# EAGLE design pc shield (EAGLE 8.3.2)
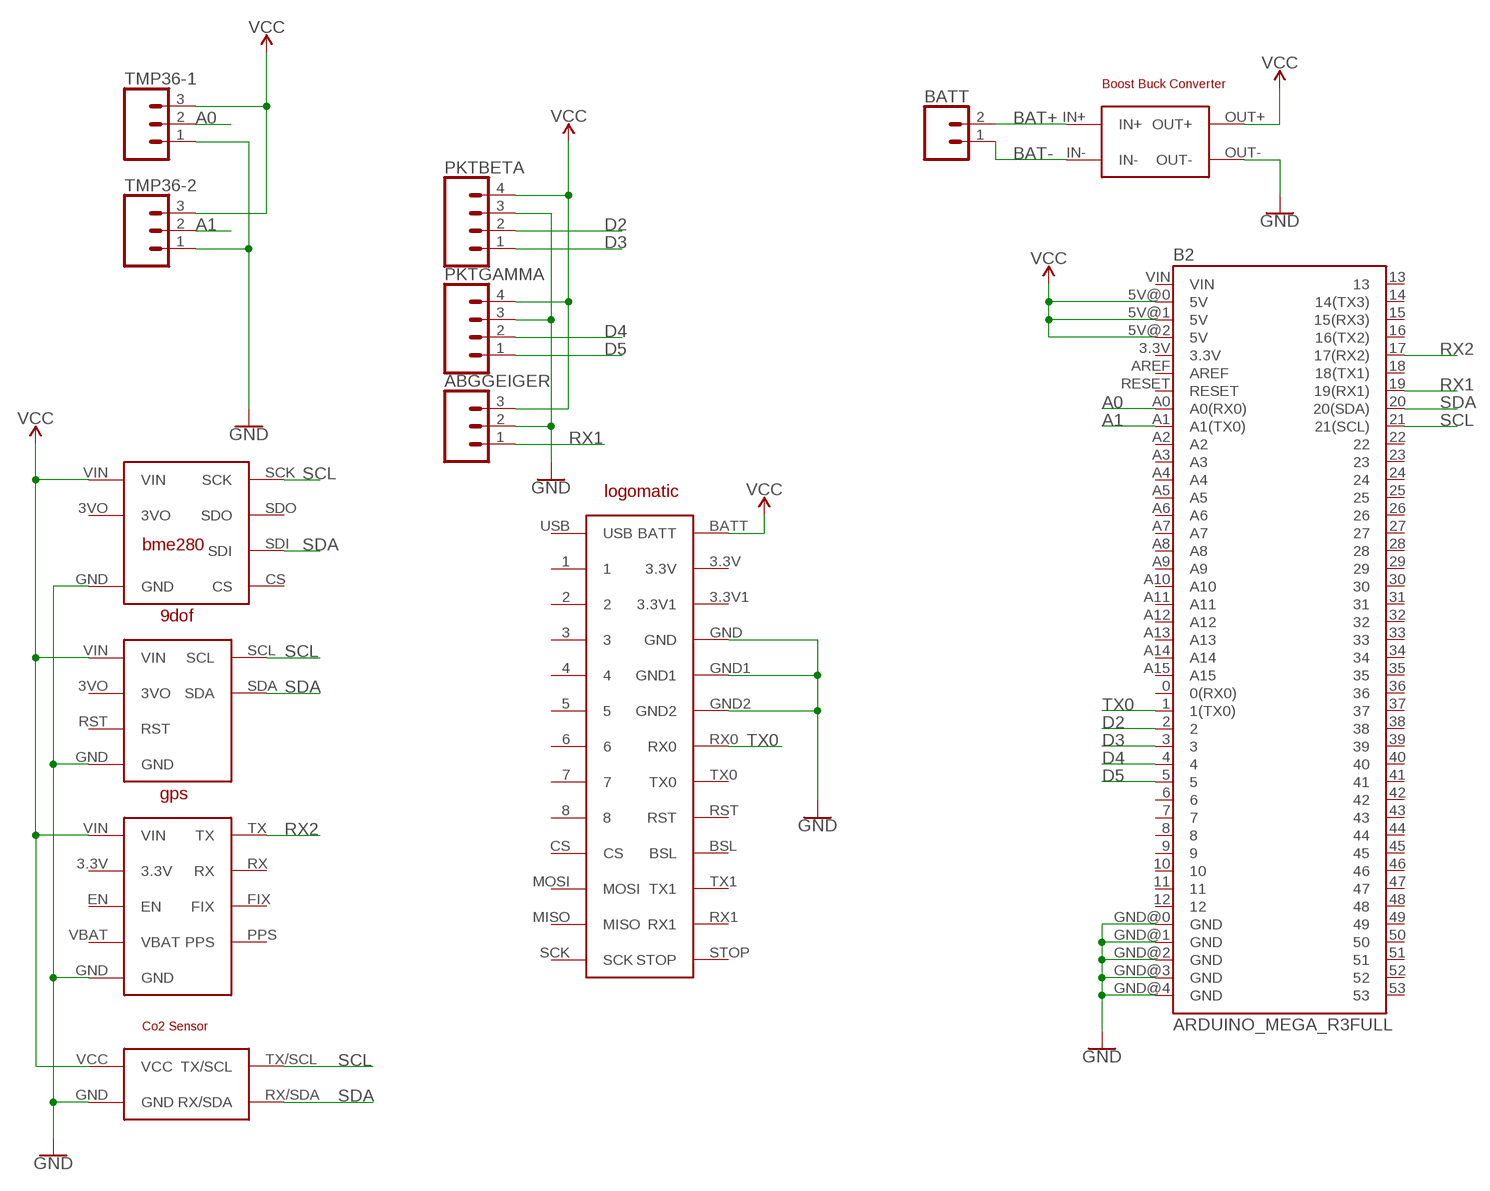
[diagram p0: schematic, sheet 1]

## Parts
ABGGEIGER  CONN_03  [1X03]
B2  ARDUINO_MEGA_R3FULL  [ARDUINO_MEGA]
BATT  CONN_02  [1X02]
PKTBETA  CONN_04  [1X04]
PKTGAMMA  CONN_04  [1X04]
TMP36-1  CONN_03  [1X03]
TMP36-2  CONN_03  [1X03]
U$1  ULTIMATEGPS  [ULTIMATEGPSPKG]
U$2  BME280  [BME280ADAFRUITPKG]
U$3  LOGOMATIC  [LOGOMATICPKG]
U$4  NXP9DOF  [NXP9DOFPKG]
U$5  CO2SENSOR  [CO2INTERFACEBOARDPKG]
U$6  BOOSTBUCK  [BOOSTBUCKPKG]

## Nets
A0: B2.A0(A0(RX0)) TMP36-1.2
A1: B2.A1(A1(TX0)) TMP36-2.2
BAT+: BATT.2 U$6.IN+
BAT-: BATT.1 U$6.IN-
D2: B2.2 PKTBETA.2
D3: B2.3 PKTBETA.1
D4: B2.4 PKTGAMMA.2
D5: B2.5 PKTGAMMA.1
GND: ABGGEIGER.2 B2.GND@0(GND) B2.GND@1(GND) B2.GND@2(GND) B2.GND@3(GND) B2.GND@4(GND) PKTBETA.3 PKTGAMMA.3 TMP36-1.1 TMP36-2.1 U$1.GND U$2.GND U$3.GND U$3.GND1 U$3.GND2 U$4.GND U$5.GND U$6.OUT-
RX1: ABGGEIGER.1 B2.19(19(RX1))
RX2: B2.17(17(RX2)) U$1.TX
SCL: B2.21(21(SCL)) U$2.SCK U$4.SCL U$5.TX/SCL
SDA: B2.20(20(SDA)) U$2.SDI U$4.SDA U$5.RX/SDA
TX0: B2.1(1(TX0)) U$3.RX0
VCC: ABGGEIGER.3 B2.5V@0(5V) B2.5V@1(5V) B2.5V@2(5V) PKTBETA.4 PKTGAMMA.4 TMP36-1.3 TMP36-2.3 U$1.VIN U$2.VIN U$3.BATT U$4.VIN U$5.VCC U$6.OUT+
Unconnected: B2.0(0(RX0)) B2.3.3V B2.6 B2.7 B2.8 B2.9 B2.10 B2.11 B2.12 B2.13 B2.14(14(TX3)) B2.15(15(RX3)) B2.16(16(TX2)) B2.18(18(TX1)) B2.22 B2.23 B2.24 B2.25 B2.26 B2.27 B2.28 B2.29 B2.30 B2.31 B2.32 B2.33 B2.34 B2.35 B2.36 B2.37 B2.38 B2.39 B2.40 B2.41 B2.42 B2.43 B2.44 B2.45 B2.46 B2.47 B2.48 B2.49 B2.50 B2.51 B2.52 B2.53 B2.A2 B2.A3 B2.A4 B2.A5 B2.A6 B2.A7 B2.A8 B2.A9 B2.A10 B2.A11 B2.A12 B2.A13 B2.A14 B2.A15 B2.AREF B2.RESET B2.VIN U$1.3.3V U$1.EN U$1.FIX U$1.PPS U$1.RX U$1.VBAT U$2.3VO U$2.CS U$2.SDO U$3.1 U$3.2 U$3.3 U$3.3.3V U$3.3.3V1 U$3.4 U$3.5 U$3.6 U$3.7 U$3.8 U$3.BSL U$3.CS U$3.MISO U$3.MOSI U$3.RST U$3.RX1 U$3.SCK U$3.STOP U$3.TX0 U$3.TX1 U$3.USB U$4.3VO U$4.RST

## Library data of the parts
ABGGEIGER TMP36-1 TMP36-2 = SparkFun-Connectors:CONN_03: Multi connection point. Often used as Generic Header-pin footprint for 0.1 inch spaced/style header connections On any of the 0.1 inch spaced packages, you can populate with these: Break Away Headers - Straight <https://www.sparkfun.com/products/116> (PRT-00116) Break Away Male Headers - Right Angle <https://www.sparkfun.com/products/553> (PRT-00553) Female Headers <https://www.sparkfun.com/products/115> (PRT-00115) Break Away Headers - Machine Pin <https://www.sparkfun.com/products/117> (PRT-00117) Break Away Female Headers - Swiss Machine Pin <https://www.sparkfun.com/products/743> (PRT-00743) Stackable Header - 3 Pin (Female, 0.1") <https://www.sparkfun.com/products/13875> (PRT-13875) For SCREWTERMINALS and SPRING TERMINALS visit here: Screw Terimnals on SparkFun.com <https://www.sparkfun.com/search/results?term=Screw+Terminals> (5mm/3.5mm/2.54mm spacing) This device is also useful as a general connection point to wire up your design to another part of your project. Our various solder wires solder well into these plated through hole pads. Hook-Up Wire - Assortment (Stranded, 22 AWG) <https://www.sparkfun.com/products/11375> (PRT-11375) Hook-Up Wire - Assortment (Solid Core, 22 AWG) <https://www.sparkfun.com/products/11367> (PRT-11367) View the entire wire category on our website here <https://www.sparkfun.com/categories/141> Special notes: Molex polarized connector foot print use with SKU : PRT-08232 with associated crimp pins and housings.
B2 = SparkFun-Boards:ARDUINO_MEGA_R3: Arduino Mega R3 ATmega2560 R3 compatible footprint. SparkFun Products: Arduino Mega 2560 R3 <https://www.sparkfun.com/products/11061>
BATT = SparkFun-Connectors:CONN_02: Multi connection point. Often used as Generic Header-pin footprint for 0.1 inch spaced/style header connections On any of the 0.1 inch spaced packages, you can populate with these: Break Away Headers - Straight <https://www.sparkfun.com/products/116> (PRT-00116) Break Away Male Headers - Right Angle <https://www.sparkfun.com/products/553> (PRT-00553) Female Headers <https://www.sparkfun.com/products/115> (PRT-00115) Break Away Headers - Machine Pin <https://www.sparkfun.com/products/117> (PRT-00117) Break Away Female Headers - Swiss Machine Pin <https://www.sparkfun.com/products/743> (PRT-00743) For SCREWTERMINALS and SPRING TERMINALS visit here: Screw Terimnals on SparkFun.com <https://www.sparkfun.com/search/results?term=Screw+Terminals> (5mm/3.5mm/2.54mm spacing) This device is also useful as a general connection point to wire up your design to another part of your project. Our various solder wires solder well into these plated through hole pads. Hook-Up Wire - Assortment (Stranded, 22 AWG) <https://www.sparkfun.com/products/11375> (PRT-11375) Hook-Up Wire - Assortment (Solid Core, 22 AWG) <https://www.sparkfun.com/products/11367> (PRT-11367) View the entire wire category on our website here <https://www.sparkfun.com/categories/141> Special notes: Molex polarized connector foot print use with: PRT-08233 with associated crimp pins and housings. 2.54_SCREWTERM for use with PRT-10571. 3.5mm Screw Terminal footprints for PRT-08084 5mm Screw Terminal footprints for use with PRT-08432
PKTBETA PKTGAMMA = SparkFun-Connectors:CONN_04: Multi connection point. Often used as Generic Header-pin footprint for 0.1 inch spaced/style header connections On any of the 0.1 inch spaced packages, you can populate with these: Break Away Headers - Straight <https://www.sparkfun.com/products/116> (PRT-00116) Break Away Male Headers - Right Angle <https://www.sparkfun.com/products/553> (PRT-00553) Female Headers <https://www.sparkfun.com/products/115> (PRT-00115) Break Away Headers - Machine Pin <https://www.sparkfun.com/products/117> (PRT-00117) Break Away Female Headers - Swiss Machine Pin <https://www.sparkfun.com/products/743> (PRT-00743) For SCREWTERMINALS and SPRING TERMINALS visit here: Screw Terimnals on SparkFun.com <https://www.sparkfun.com/search/results?term=Screw+Terminals> (5mm/3.5mm/2.54mm spacing) This device is also useful as a general connection point to wire up your design to another part of your project. Our various solder wires solder well into these plated through hole pads. Hook-Up Wire - Assortment (Stranded, 22 AWG) <https://www.sparkfun.com/products/11375> (PRT-11375) Hook-Up Wire - Assortment (Solid Core, 22 AWG) <https://www.sparkfun.com/products/11367> (PRT-11367) View the entire wire category on our website here <https://www.sparkfun.com/categories/141> Special notes: Molex polarized connector foot print use with SKU : PRT-08231 with associated crimp pins and housings. 1MM SMD Version SKU: PRT-10208; PROD_ID: CONN-09696
U$1 = ultimategps:ULTIMATEGPS
U$2 = bme280:BME280
U$3 = logomatic:LOGOMATIC
U$4 = nxp9dof:NXP9DOF
U$5 = co2Sensor:CO2SENSOR
U$6 = boostbuck:BOOSTBUCK

## Board
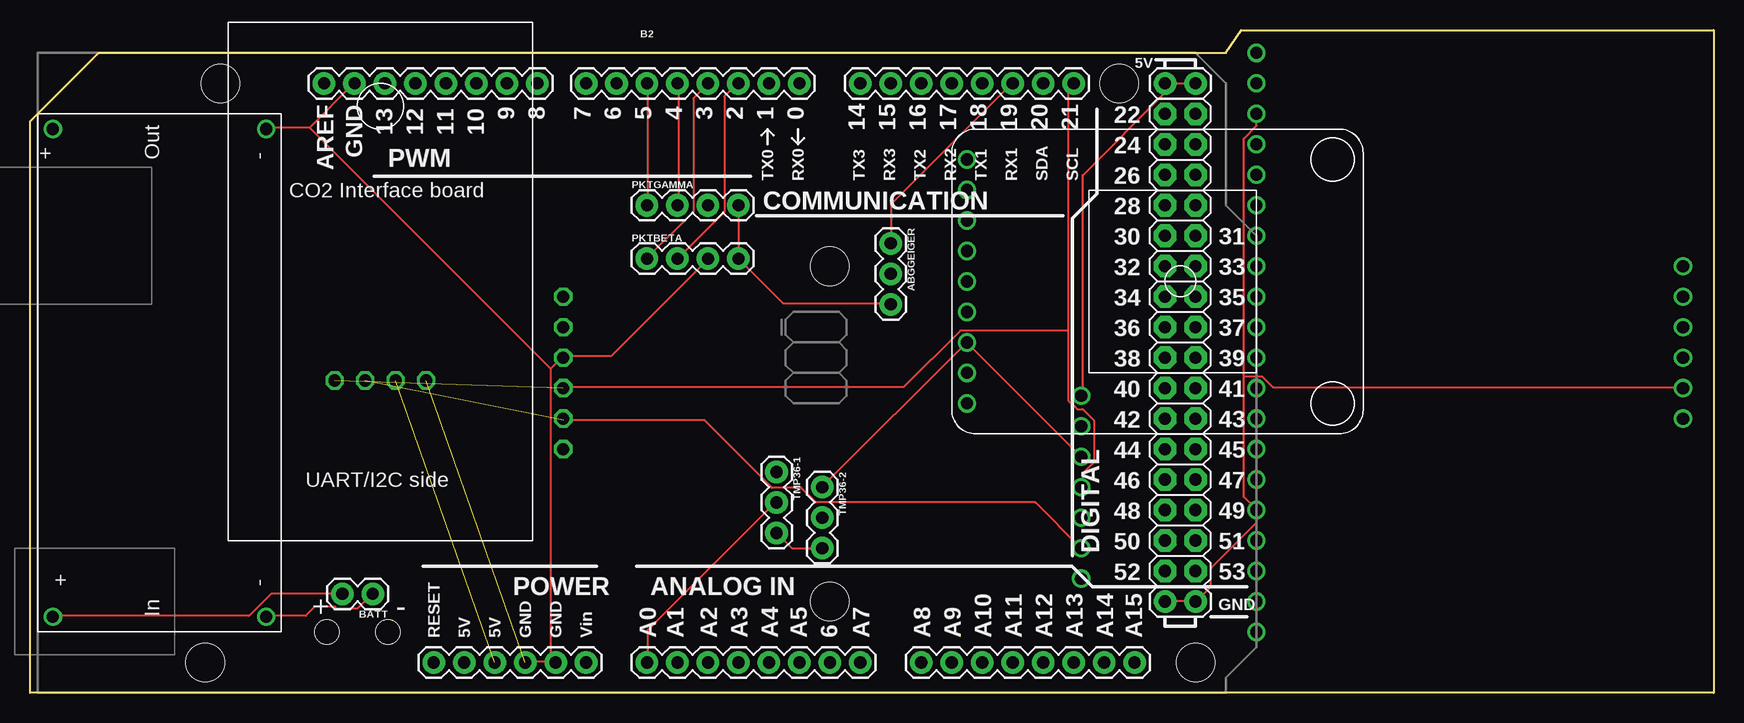
[diagram p1: board, top side]
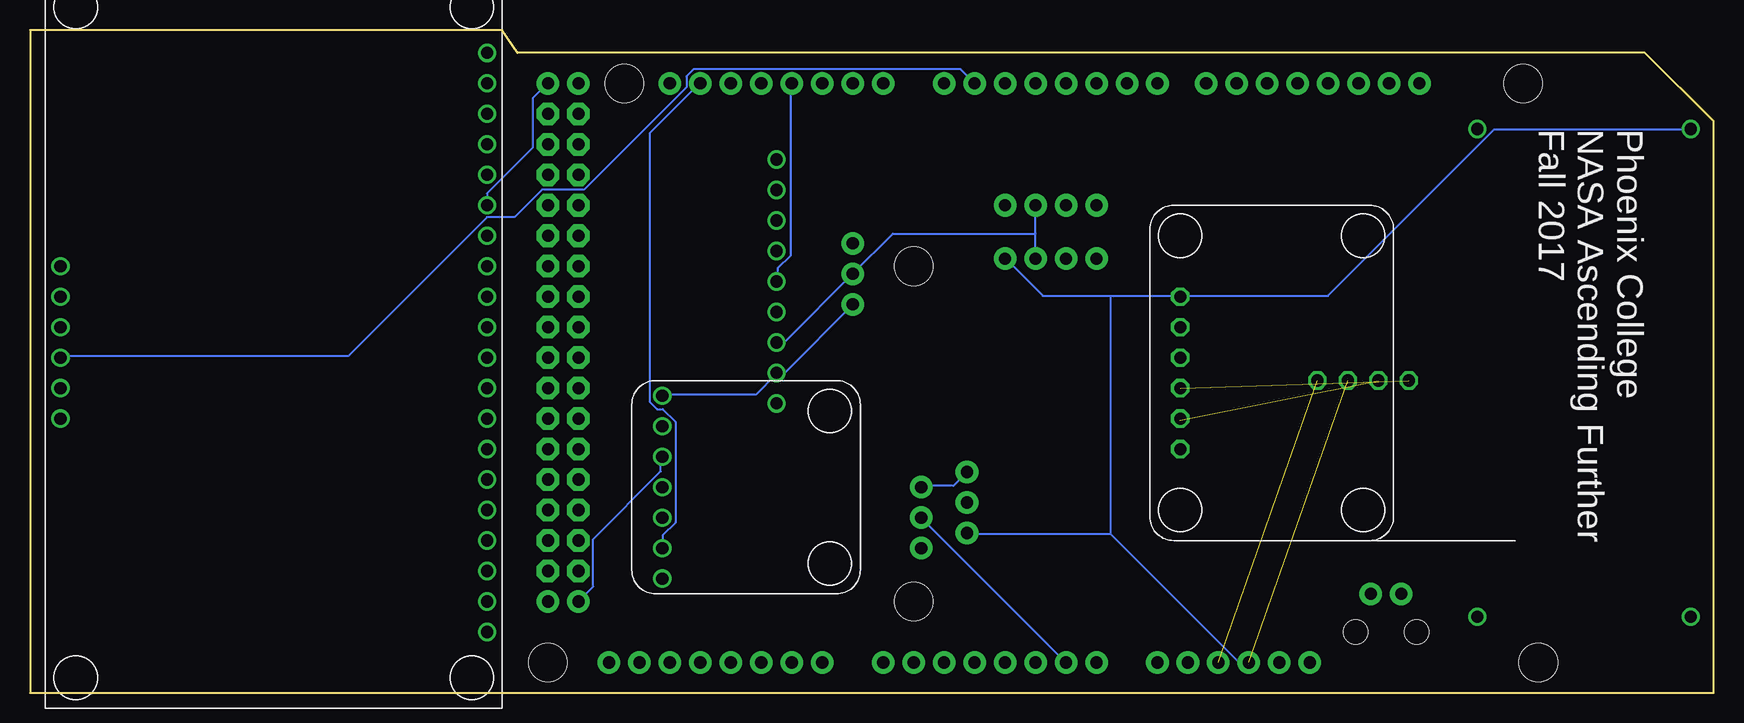
[diagram p2: board, bottom side, seen from below]

Size 140.33 x 55.24 mm. Coordinates in mm from the lower left corner, seen from the top.
Outline: 0,0 0,47.62 5.71,53.34 99.7,53.34 100.97,55.24 140.33,55.24 140.33,0 0,0
Copper layers (1*16): Top 0.035mm / dielectric 1.5mm / Bottom 0.035mm
Design rules "default": minimum track width 6mil, minimum drill 0.35mm, track to track 6mil, track to pad 6mil, pad to pad 6mil, via to via 6mil, smd to smd 6mil, copper to edge 40mil, drill to drill 6mil, minimum pad ring 10mil, minimum via ring 8mil, stop-mask expansion 4mil, vias tented up to drill 0mil, thermal gap 10mil
Holes 2.03 mm at 29.84,5.08 24.77,5.08

### Footprints (pad centres in the part's own frame; a part is rotated, then mirrored left to right if it is on the bottom)
1X03 = drill 1.016 pad 1.88: 1 0,0; 2 2.54,0; 3 5.08,0
ARDUINO_MEGA = drill 1.016 pad 1.88: 0 13.97,24.13; 1 11.43,24.13; 2 8.89,24.13; 3 6.35,24.13; 3.3V -13.97,-24.13; 4 3.81,24.13; 5 1.27,24.13; 5V@0 -11.43,-24.13; 5V@1 44.45,24.13; 5V@2 46.99,24.13; 6 -1.27,24.13; 7 -3.81,24.13; 8 -7.874,24.13; 9 -10.414,24.13; 10 -12.954,24.13; 11 -15.494,24.13; 12 -18.034,24.13; 13 -20.574,24.13; 14 19.05,24.13; 15 21.59,24.13; 16 24.13,24.13; 17 26.67,24.13; 18 29.21,24.13; 19 31.75,24.13; 20 34.29,24.13; 21 36.83,24.13; A0 1.27,-24.13; A1 3.81,-24.13; A2 6.35,-24.13; A3 8.89,-24.13; A4 11.43,-24.13; A5 13.97,-24.13; A6 16.51,-24.13; A7 19.05,-24.13; A8 24.13,-24.13; A9 26.67,-24.13; A10 29.21,-24.13; A11 31.75,-24.13; A12 34.29,-24.13; A13 36.83,-24.13; A14 39.37,-24.13; A15 41.91,-24.13; AREF -25.654,24.13; GND@0 -8.89,-24.13; GND@1 -6.35,-24.13; GND@2 44.45,-19.05; GND@3 46.99,-19.05; GND@4 -23.114,24.13; RESET -16.51,-24.13; VIN -3.81,-24.13 | drill 1.016 pad 1.88 octagon: 22 44.45,21.59; 23 46.99,21.59; 24 44.45,19.05; 25 46.99,19.05; 26 44.45,16.51; 27 46.99,16.51; 28 44.45,13.97; 29 46.99,13.97; 30 44.45,11.43; 31 46.99,11.43; 32 44.45,8.89; 33 46.99,8.89; 34 44.45,6.35; 35 46.99,6.35; 36 44.45,3.81; 37 46.99,3.81; 38 44.45,1.27; 39 46.99,1.27; 40 44.45,-1.27; 41 46.99,-1.27; 42 44.45,-3.81; 43 46.99,-3.81; 44 44.45,-6.35; 45 46.99,-6.35; 46 44.45,-8.89; 47 46.99,-8.89; 48 44.45,-11.43; 49 46.99,-11.43; 50 44.45,-13.97; 51 46.99,-13.97; 52 44.45,-16.51; 53 46.99,-16.51 | hole 3.2: -34.29,24.13; -35.56,-24.13; 16.51,8.89; 16.51,-19.05; 40.64,24.13; 46.99,-24.13
1X02 = drill 1.016 pad 1.88: 1 0,0; 2 2.54,0
1X04 = drill 1.016 pad 1.88: 1 0,0; 2 2.54,0; 3 5.08,0; 4 7.62,0
ULTIMATEGPSPKG = drill 1.016: 3.3V 0,0; EN 2.54,0; FIX 7.62,0; GND 15.24,0; PPS 20.32,0; RX 12.7,0; TX 10.16,0; VBAT 5.08,0; VIN 17.78,0
BME280ADAFRUITPKG = drill 1.016: 3VO 2.54,0; CS 15.24,0; GND 5.08,0; SCK 7.62,0; SDI 12.7,0; SDO 10.16,0; VIN 0,0
LOGOMATICPKG = drill 1.016: 1 7.62,-20.32; 2 5.08,-20.32; 3 2.54,-20.32; 3.3V -5.08,15.24; 3.3V1 17.78,-20.32; 4 0,-20.32; 5 -2.54,-20.32; 6 -5.08,-20.32; 7 -7.62,-20.32; 8 -10.16,-20.32; BATT 12.7,-20.32; BSL 7.62,15.24; CS -15.24,-20.32; GND -2.54,15.24; GND1 20.32,-20.32; GND2 -12.7,-20.32; MISO -20.32,-20.32; MOSI -17.78,-20.32; RST 5.08,15.24; RX0 0,15.24; RX1 25.4,-20.32; SCK -22.86,-20.32; STOP 10.16,-20.32; TX0 2.54,15.24; TX1 22.86,-20.32; USB 15.24,-20.32
NXP9DOFPKG = drill 1.016 octagon: 3VO -3.81,0; GND -1.27,0; RST 6.35,0; SCL 1.27,0; SDA 3.81,0; VIN -6.35,0
CO2INTERFACEBOARDPKG = drill 1.016 octagon: GND 0.635,1.27; RX/SDA 0.635,6.35; TX/SCL 0.635,8.89; VCC 0.635,3.81
BOOSTBUCKPKG = drill 1.016: IN+ -19.05,8.89; IN- -19.05,-8.89; OUT+ 21.59,8.89; OUT- 21.59,-8.89

### Placement (x,y rotation side)
ABGGEIGER  71.75,37.47 270 top
B2  50.16,26.67 0 top
BATT  28.58,8.25 180 top
PKTBETA  51.44,36.19 0 top
PKTGAMMA  51.44,40.64 0 top
TMP36-1  62.23,18.41 270 top
TMP36-2  66.04,17.15 270 top
U$1  78.11,44.45 270 top
U$2  87.63,24.76 270 bottom
U$3  122.56,27.94 90 bottom
U$4  44.45,26.67 270 bottom
U$5  34.29,25.4 90 top
U$6  10.79,25.4 90 top

### Tracks (layer width: path | path; a pad name or v marks a point on that pad's centre or on a via)
A0
  Top 0.152: B2.A0 51.49,2.62 51.49,5.21 62.15,15.88 TMP36-1.2
A1
  Bottom 0.152: B2.A1 54.08,2.62 65.96,14.5 TMP36-2.2
BAT+
  Top 0.152: BATT.2 20.09,8.25 18.26,6.43 1.96,6.43 U$6.IN+
BAT-
  Top 0.152: U$6.IN- 19.79,6.43 22.99,6.43 23.75,7.19 25.43,7.19 25.58,7.04 27.25,7.04 28.47,8.25 BATT.1
D2
  Top 0.152: PKTBETA.2 57.89,40.11 57.89,49.71 58.95,50.77 B2.2
D3
  Top 0.152: PKTBETA.1 51.49,36.3 55.3,40.11 55.3,49.55 56.52,50.77 B2.3
D4
  Top 0.152: PKTGAMMA.2 54.08,40.72 54.08,50.77 B2.4
D5
  Top 0.152: PKTGAMMA.1 51.49,40.72 51.49,50.77 B2.5
GND  (1 unrouted)
  Top 0.152: 23.29,47.12 19.79,47.12 U$6.OUT- | 23.29,47.12 26.95,50.77 B2.GND@4 | 43.41,2.62 43.71,2.62 B2.GND@1 43.41,2.62 | 43.41,2.62 41.27,2.62 B2.GND@0 | PKTBETA.3 56.52,36.14 48.44,28.07 44.48,28.07 U$4.GND 44.32,27.91 43.41,27 | 43.41,27 43.41,2.62 | 43.41,27 23.29,47.12 | U$2.GND 87.61,19.69 78.16,29.13 U$1.GND 78,29.13 66.12,17.25 TMP36-2.1 | U$3.GND1 102.23,47.27 101.17,46.2 101.17,26.39 | 101.17,26.39 101.17,16.33 102.23,15.26 U$3.GND2 102.23,14.2 98.42,10.39 98.42,8.87 97.21,7.65 B2.GND@3 97.05,7.65 94.61,7.65 B2.GND@2 | 101.17,26.39 102.69,26.39 103.61,25.48 137.74,25.48 U$3.GND
  Bottom 0.152: PKTBETA.3 56.52,38.28 | 56.52,38.28 PKTGAMMA.3 | TMP36-2.1 65.96,17.25 63.37,17.25 62.31,18.31 TMP36-1.1 | U$1.GND 78,29.29 77.39,29.29 ABGGEIGER.2 68.4,38.28 56.52,38.28 | U$2.GND 87.76,19.69 87.76,18.47 93.4,12.83 93.4,8.87 94.61,7.65 B2.GND@2
RX1
  Top 0.152: ABGGEIGER.1 71.75,40.72 81.81,50.77 B2.19
RX2
  Bottom 0.152: U$1.TX 78,34.31 78,35.38 76.94,36.45 76.94,50.77 B2.17
SCL  (1 unrouted)
  Top 0.152: 86.54,30.2 86.54,50.32 87,50.77 B2.21 | 86.54,30.2 86.54,24.41 87.3,23.65 87.76,23.65 88.67,22.73 88.67,19.23 87.76,18.31 87.76,17.25 U$2.SCK | 86.54,30.2 77.55,30.2 72.82,25.48 44.48,25.48 U$4.SCL
SDA  (1 unrouted)
  Top 0.152: U$4.SDA 44.48,22.73 56.21,22.73 61.85,17.09 64.29,17.09 65.51,15.88 83.8,15.88 87.61,12.06 U$2.SDI
  Bottom 0.152: U$2.SDI 87.61,12.06 87.61,13.13 86.54,14.2 86.54,22.58 87.61,23.65 88.06,23.65 88.67,24.26 88.67,46.66 84.56,50.77 B2.20
TX0
  Bottom 0.152: U$3.RX0 137.74,28.07 113.82,28.07 102.23,39.65 99.95,39.65 97.66,41.94 94.16,41.94 85.62,50.47 85.62,51.38 85.01,51.99 62.76,51.99 61.7,50.93 B2.1
VCC  (1 unrouted)
  Top 0.152: 94.61,50.77 97.05,50.77 B2.5V@2 | 94.61,50.77 94.61,50.01 87.76,43.16 87.76,24.87 U$2.VIN | 94.61,50.77 B2.5V@1 | TMP36-2.3 63.52,12.06 62.31,13.28 TMP36-1.3 | PKTGAMMA.4 59.11,40.56 59.11,36.3 PKTBETA.4 62.76,32.49 71.75,32.49 ABGGEIGER.3
  Bottom 0.152: U$3.BATT 102.23,41.63 98.42,45.44 98.42,49.55 97.21,50.77 B2.5V@2 | ABGGEIGER.3 71.75,32.33 77.39,26.69 78,26.69 U$1.VIN 78.16,26.54 79.83,24.87 87.61,24.87 U$2.VIN | 50.27,13.28 39.6,2.62 38.84,2.62 B2.5V@0 | 50.27,13.28 62.15,13.28 TMP36-1.3 | 50.27,33.1 55.91,33.1 58.95,36.14 PKTBETA.4 | 50.27,33.1 44.48,33.1 U$4.VIN 44.32,33.1 32.13,33.1 18.26,46.97 1.96,46.97 U$6.OUT+ | 50.27,33.1 50.27,13.28

### Text on the board
tPlace: + | -
bPlace: Phoenix College / NASA Ascending Further / Fall 2017